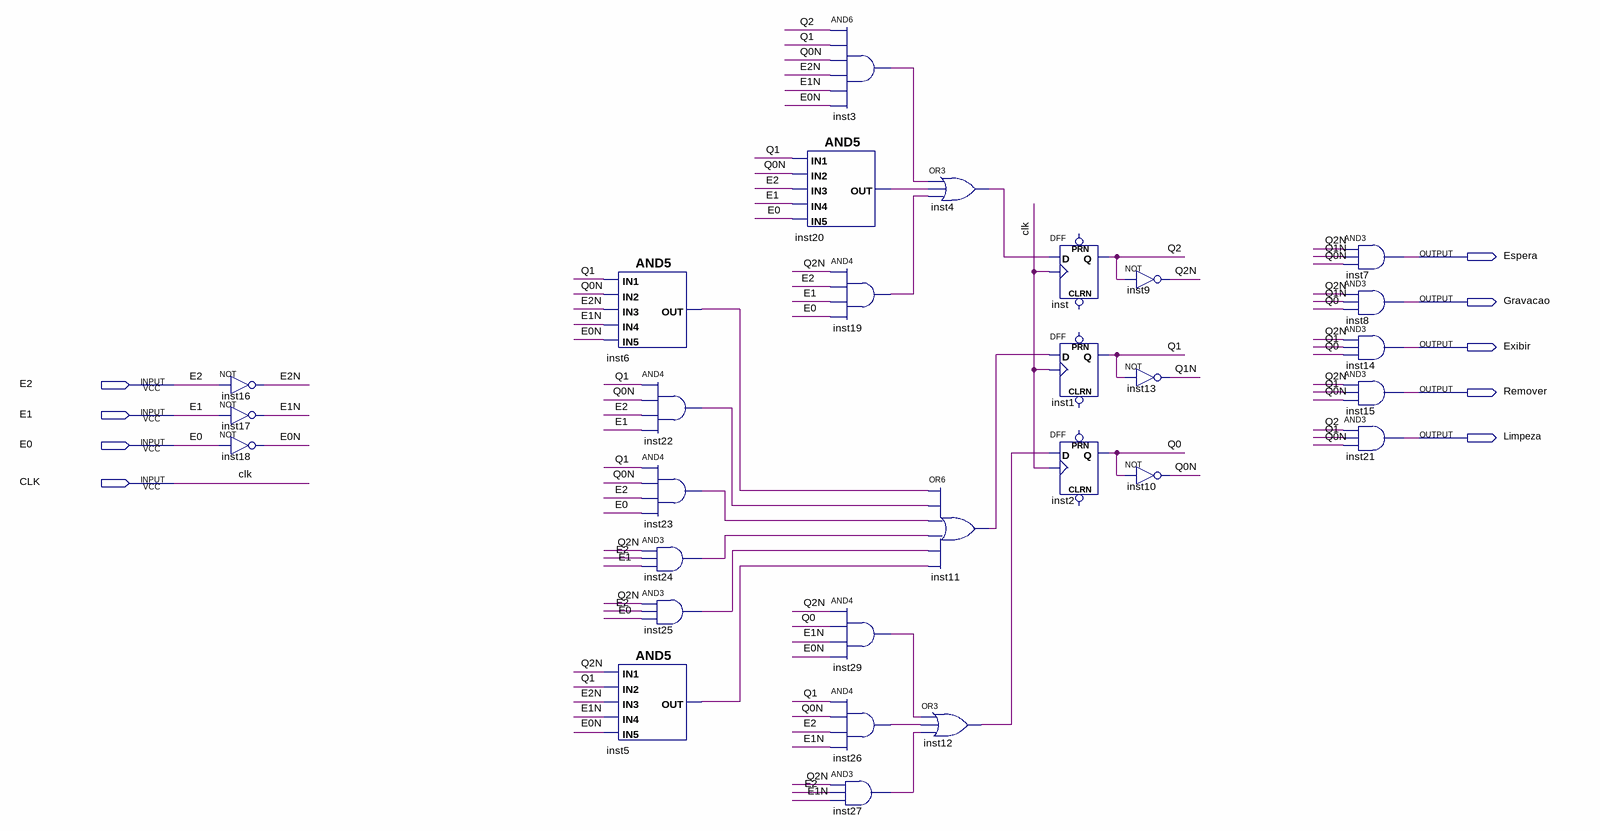
[diagram p0: schematic sheet]
// Quartus schematic maquina_central.bdf as structural Verilog: 29 symbols, 9 pins
module maquina_central (
  input  E2,
  input  E1,
  input  E0,
  input  CLK,
  output Espera,
  output Gravacao,
  output Exibir,
  output Remover,
  output Limpeza
);

  wire E0N, E1N, E2N, inst3_out, inst4_out, inst5_out, inst6_out, inst11_out, inst12_out, inst19_out,
       inst20_out, inst22_out, inst23_out, inst24_out, inst25_out, inst26_out, inst27_out, inst29_out, Q0,
       Q0N, Q1, Q1N, Q2, Q2N;

  not inst16 (E2N, E2);
  not inst17 (E1N, E1);
  not inst18 (E0N, E0);
  and inst6 (inst6_out, Q1, Q0N, E2N, E1N, E0N);
  and inst5 (inst5_out, Q2N, Q1, E2N, E1N, E0N);
  and inst22 (inst22_out, Q1, Q0N, E2, E1);
  and inst23 (inst23_out, Q1, Q0N, E2, E0);
  and inst24 (inst24_out, Q2N, E2, E1);
  and inst25 (inst25_out, Q2N, E2, E0);
  and inst3 (inst3_out, Q2, Q1, Q0N, E2N, E1N, E0N);
  and inst20 (inst20_out, Q1, Q0N, E2, E1, E0);
  and inst19 (inst19_out, Q2N, E2, E1, E0);
  and inst29 (inst29_out, Q2N, Q0, E1N, E0N);
  and inst26 (inst26_out, Q1, Q0N, E2, E1N);
  and inst27 (inst27_out, Q2N, E2, E1N);
  or inst4 (inst4_out, inst3_out, inst20_out, inst19_out);
  or inst11 (inst11_out, inst6_out, inst22_out, inst23_out, inst24_out, inst25_out, inst5_out);
  or inst12 (inst12_out, inst29_out, inst26_out, inst27_out);
  DFF inst (.CLK(CLK), .D(inst4_out), .Q(Q2));  // open: CLRN, PRN
  DFF inst1 (.CLK(CLK), .D(inst11_out), .Q(Q1));  // open: CLRN, PRN
  DFF inst2 (.CLK(CLK), .D(inst12_out), .Q(Q0));  // open: CLRN, PRN
  not inst9 (Q2N, Q2);
  not inst13 (Q1N, Q1);
  not inst10 (Q0N, Q0);
  and inst7 (Espera, Q2N, Q1N, Q0N);
  and inst8 (Gravacao, Q2N, Q1N, Q0);
  and inst14 (Exibir, Q2N, Q1, Q0);
  and inst15 (Remover, Q2N, Q1, Q0N);
  and inst21 (Limpeza, Q2, Q1, Q0N);
endmodule
